# Altium schematic sheet Sheet3.SchDoc
size A4; Organization: Altium Limited; Address1: L3, 12a Rodborough Rd; Address2: Frenchs Forest; Address3: NSW; Address4: Australia 2086
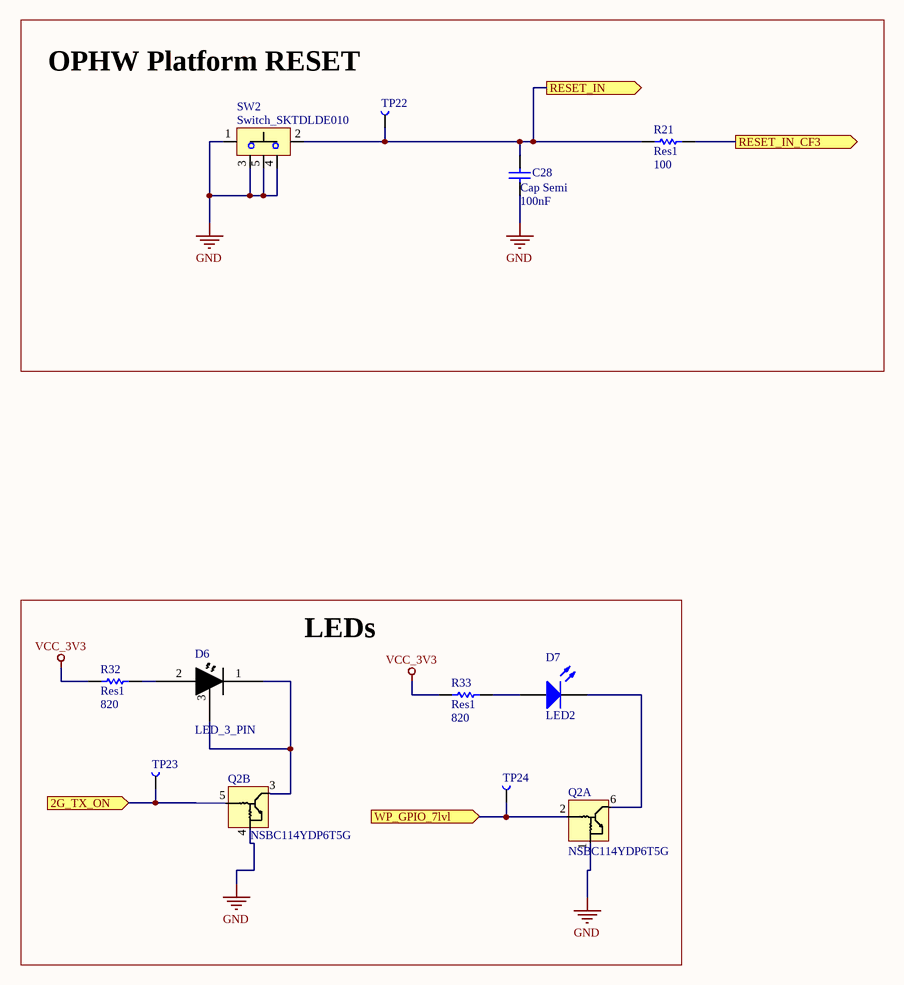
[diagram p0: Sheet3.SchDoc]

## Parts
C28  Cap Semi  value 100nF  [CAP 0402/1005]
D6  LED_3_PIN  [LED_3_PIN]
D7  LED2  [LED_0603 - 3D]
Q2  NSBC114YDP6T5G  [NSBC114YDP6T5G]  (parts A,B of 2)
R21  Res1  value 100  [RES 0402/1005]
R32  Res1  value 820  [RES 0402/1005]
R33  Res1  value 820  [RES 0402/1005]
SW2  Switch_SKTDLDE010  [Switch_SKTDLDE010]
TP22  TestPoint  [TestPoint]  (value not drawn)
TP23  TestPoint  [TestPoint]  (value not drawn)
TP24  TestPoint  [TestPoint]  (value not drawn)

## Blocks framed on the sheet
OPHW Platform RESET: C28 R21 SW2 TP22
LEDs: D6 D7 Q2 R32 R33 TP23 TP24

## Ports
2G_TX_ON (in), RESET_IN (out), RESET_IN_CF3 (out), WP_GPIO_7lvl (in)

## Nets
GND: C28.1 Q2.1 Q2.4 SW2.1 SW2.3 SW2.4 SW2.5
VCC_3V3: R32.2 R33.2
2G_TX_ON: Q2.5 TP23.1(TP) ; port 2G_TX_ON
RESET_IN: C28.2 R21.1 SW2.2 TP22.1(TP) ; port RESET_IN
RESET_IN_CF3: R21.2 ; port RESET_IN_CF3
WP_GPIO_7lvl: Q2.2 TP24.1(TP) ; port WP_GPIO_7lvl
NetD6_1: D6.1 D6.3 Q2.3
NetD6_2: D6.2 R32.1
NetD7_1: D7.1(A) R33.1
NetD7_2: D7.2(K) Q2.6

## Notes on the sheet
- Title
- Size:
- Date:
- A4
- Number:
- Time:
- Revision:
- Sheet
- of
- File:

## Library data of the parts
C28 = Cap Semi: 0.1µF -20%, +80% 16V Ceramic Capacitor Y5V (F) 0402 (1005 Metric); Part Number: VJ0402V104ZXJCW1BC; Published: 8-Jun-2000; LatestRevisionDate: 29-May-2009; LatestRevisionNote: IPC-7351 Footprint Added.; PackageReference: C1206; PackageDescription: Chip Capacitor; Supplier Link: https://www.digikey.com/product-detail/en/vishay-vitramon/VJ0402V104ZXJCW1BC/720-1523-1-ND/420979
D6 = LED_3_PIN: Yellow-Green 573nm LED Indication - Discrete 2V 2-SMD, No Lead; Part Number: 12-21SYGC/S530-E2/TR8; Supplier Link: https://www.digikey.com/product-detail/en/everlight-electronics-co-ltd/12-21SYGC-S530-E2-TR8/1080-1451-1-ND/5308153
D7 = LED2: Green  LED Indication - Discrete 2.2V 0603 (1608 Metric); Part Number: SML-310MTT86; Published: 8-Jun-2000; LatestRevisionDate: 17-Jul-2002; LatestRevisionNote: Re-released for DXP Platform.; PackageVersion: Feb-2002; PackageReference: 3.2X1.6X1.1; Publisher: Altium Limited; PackageDescription: SM LED; 2 Flat Leads; Supplier Link: https://www.digikey.com/products/en?keywords=SML-310MTT86M
Q2 = NSBC114YDP6T5G: Pre-Biased Bipolar Transistor (BJT) 2 NPN - Pre-Biased (Dual) 50V 100mA  339mW Surface Mount SOT-963; Part Number: NSBC114YDP6T5G; Supplier Link: https://www.digikey.com/product-detail/en/on-semiconductor/NSBC114YDP6T5G/NSBC114YDP6T5GOSCT-ND/9087466
R21 = Res1: 100 Ohms ±5% 0.063W, 1/16W Chip Resistor 0402 (1005 Metric) Automotive AEC-Q200 Thick Film; Part Number: MCR01MZPJ101; Available: 0; Published: 8-Jun-2000; LatestRevisionDate: 17-Jul-2002; LatestRevisionNote: Re-released for DXP Platform.; PackageReference: AXIAL-0.3; PackageDescription: Axial Device, Thru-Hole; 2 Leads; 0.3 in Pin Spacing; Supplier Link: https://www.digikey.com/product-detail/en/rohm-semiconductor/MCR01MZPJ101/RHM100JCT-ND/628224; Supplier Link 2: https://www.digikey.com/product-detail/en/yageo/AC0402JR-07100RL/YAG3516CT-ND/6006365; Part Number 2: AC0402JR-07100RL
R32 R33 = Res1: 820 Ohms ±5% 0.1W, 1/10W Chip Resistor 0402 (1005 Metric) Automotive AEC-Q200 Thick Film; Part Number: RK73B1ETTP821J; Published: 8-Jun-2000; LatestRevisionDate: 17-Jul-2002; LatestRevisionNote: Re-released for DXP Platform.; PackageReference: AXIAL-0.3; PackageDescription: Axial Device, Thru-Hole; 2 Leads; 0.3 in Pin Spacing; Supplier Link: https://www.digikey.com/product-detail/en/koa-speer-electronics-inc/RK73B1ETTP821J/2019-RK73B1ETTP821JCT-ND/9846073
SW2 = Switch_SKTDLDE010: Tactile Switches Tact Switch; Part Number: SKTDLDE010; Supplier Link: https://eu.mouser.com/ProductDetail/ALPS/SKTDLDE010?qs=RiQAlOPxzzDSD3ErBzCWyg%3D%3D